# Altium schematic sheet RederReverse.SchDoc
size A4
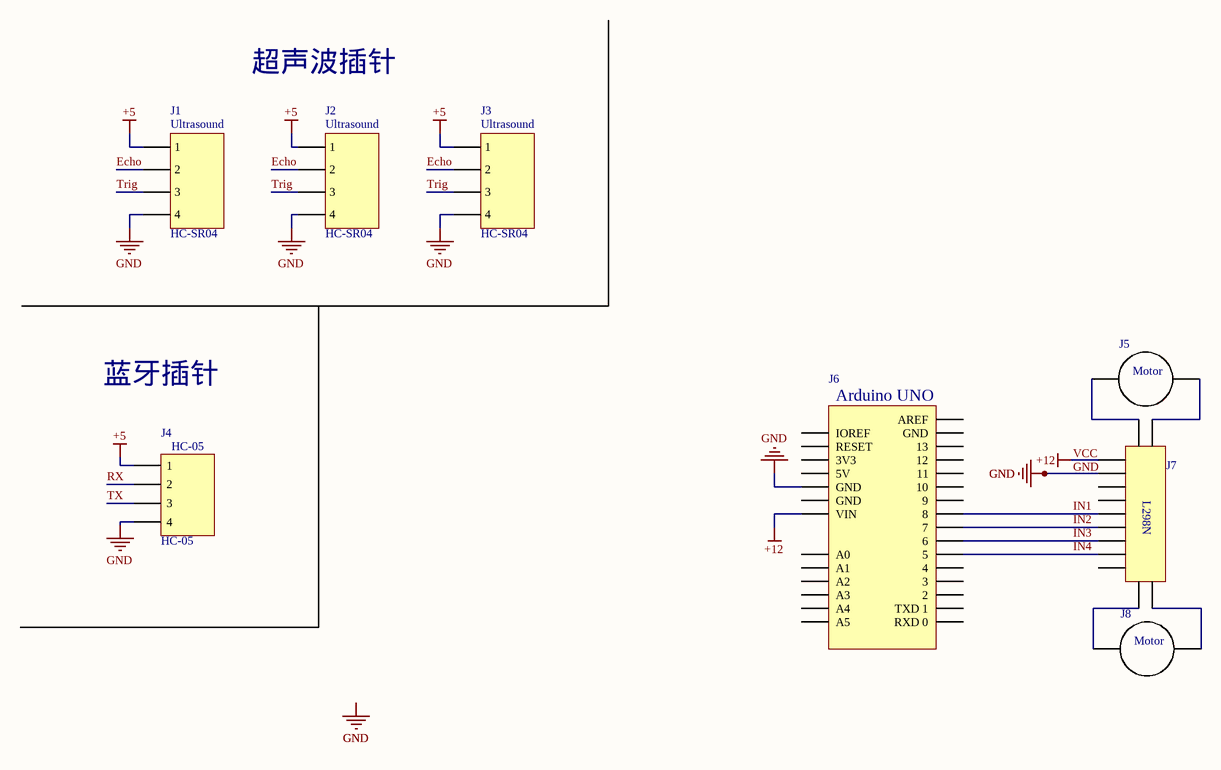
[diagram p0: RederReverse.SchDoc]

## Parts
J1  HC-SR04
J2  HC-SR04
J3  HC-SR04
J4  HC-05
J5  motor  (value not drawn)
J6  A  (value not drawn)
J7  L298N  (value not drawn)
J8  motor  (value not drawn)

## Nets
+5: J1.1 J2.1 J3.1 J4.1
+12: J6.5(A4) J7.4
GND: J1.4 J2.4 J3.4 J4.4 J6.3(A2) J7.4
Echo: J1.2 J2.2 J3.2
IN1: J6.14(8) J7.7
IN2: J6.13(7) J7.5
IN3: J6.12(6) J7.5
IN4: J6.11(5) J7.6
RX: J4.2
Trig: J1.3 J2.3 J3.3
TX: J4.3
NetJ5_1: J5.1 J7.2
NetJ5_2: J5.2 J7.1
NetJ7_3: J7.3 J8.2
NetJ7_4: J7.4 J8.1

Not connected (* = marked no-connect by the designer): J6 1(A0) 2(A1) 4(A3) 6(RXD_0) 7(TXD_1) 8(2) 9(3) 10(4) 15(9) 16(10) 17(11) 18(12) 19(13) 20(GND) 21(AREF)

## Notes on the sheet
- 超声波插针
- 蓝牙插针
- Labels drawn without touching a wire or pin: GND, VCC
- (in symbol Arduino) Arduino UNO
- (in symbol HC-SR04) Ultrasound
- (in symbol motor) Motor

## Library data of the parts
J1-J3 = HC-SR04: 超声波插针
J4 = HC-05: 蓝牙插针
J6 = Arduino